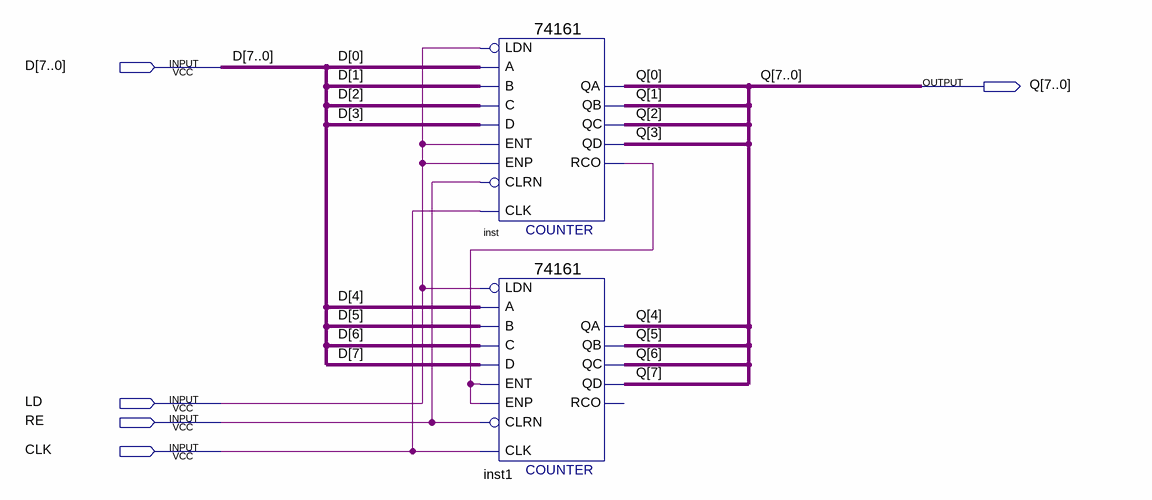
[diagram p0: schematic sheet]
// Quartus schematic uPC.bdf as structural Verilog: 2 symbols, 5 pins
module uPC (
  input  [7:0] D,
  input  LD,
  input  RE,
  input  CLK,
  output [7:0] Q
);

  wire inst_rco;

  \74161  inst (
    .CLRN(RE), .CLK(CLK), .ENP(LD), .LDN(LD), .A(D[0]), .D(D[3]), .ENT(LD), .B(D[1]), .C(D[2]), .QD(Q[3]),
    .QC(Q[2]), .QB(Q[1]), .QA(Q[0]), .RCO(inst_rco));
  \74161  inst1 (
    .CLRN(RE), .CLK(CLK), .ENP(inst_rco), .LDN(LD), .A(D[4]), .D(D[7]), .ENT(inst_rco), .B(D[5]), .C(D[6]),
    .QD(Q[7]), .QC(Q[6]), .QB(Q[5]), .QA(Q[4]));  // open: RCO
endmodule
